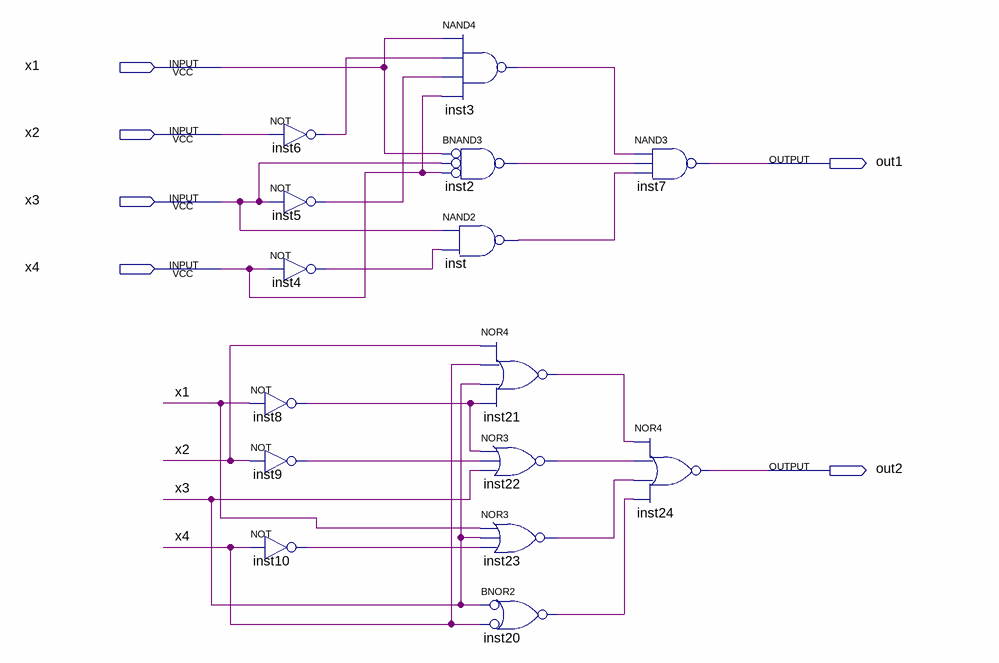
[diagram p0: schematic sheet]
// Quartus schematic lab01.bdf as structural Verilog: 15 symbols, 6 pins
module lab01 (
  input  x1,
  input  x2,
  input  x3,
  input  x4,
  output out1,
  output out2
);

  wire inst2_out, inst3_out, inst4_out, inst5_out, inst6_out, inst8_out, inst9_out, inst10_out, inst20_out,
       inst21_out, inst22_out, inst23_out, inst_out;

  not inst6 (inst6_out, x2);
  not inst5 (inst5_out, x3);
  not inst4 (inst4_out, x4);
  not inst8 (inst8_out, x1);
  not inst9 (inst9_out, x2);
  not inst10 (inst10_out, x4);
  nand inst3 (inst3_out, x1, inst6_out, inst5_out, x4);
  nand inst2 (inst2_out, ~x1, ~x3, ~x4);  // BNAND3
  nand inst (inst_out, x3, inst4_out);
  nor inst21 (inst21_out, x2, x4, x3, inst8_out);
  nor inst22 (inst22_out, inst8_out, inst9_out, x3);
  nor inst23 (inst23_out, x1, x3, inst10_out);
  nor inst20 (inst20_out, ~x3, ~x4);  // BNOR2
  nand inst7 (out1, inst3_out, inst2_out, inst_out);
  nor inst24 (out2, inst21_out, inst22_out, inst23_out, inst20_out);
endmodule
